# Altium project Light Board.PrjPCB
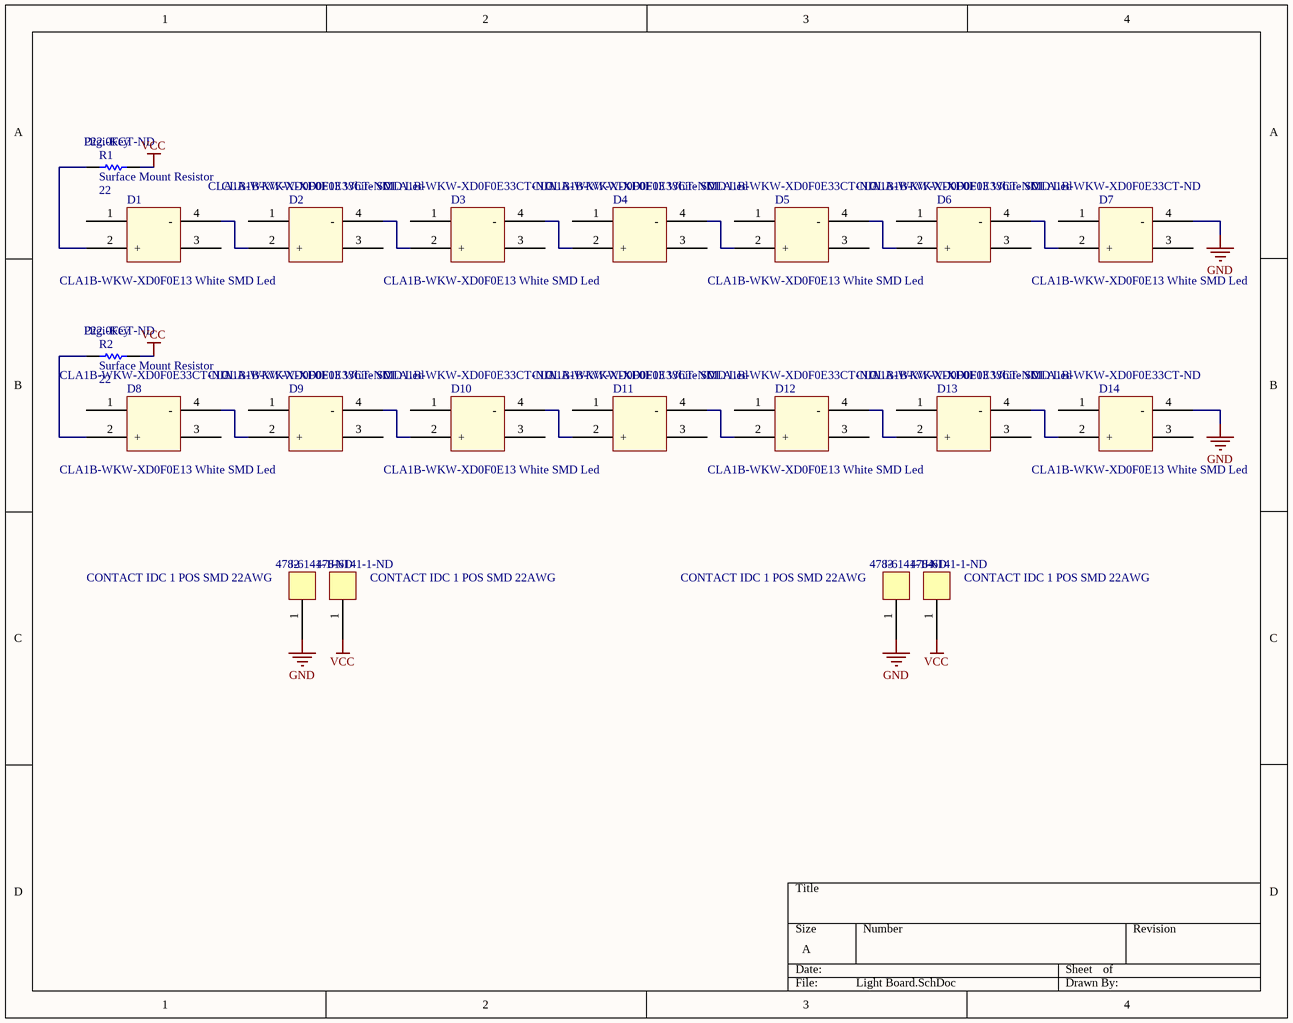
[diagram p0: Light Board.SchDoc]
1 sheet, 20 parts. Net scope: global (net labels, ports and power ports of the same name join across sheets).
Board file: Light Board.PcbDoc

## Sheet Light Board.SchDoc
size A

### Parts
D1  CLA1B-WKW-XD0F0E13 White SMD Led  [CLA1B-WKW-XD0F0E13 White SMD Led]
D2  CLA1B-WKW-XD0F0E13 White SMD Led  Supplier Part Number 1: CLA1B-WKW-XD0F0E33CT-ND  [CLA1B-WKW-XD0F0E13 White SMD Led]
D3  CLA1B-WKW-XD0F0E13 White SMD Led  Supplier Part Number 1: CLA1B-WKW-XD0F0E33CT-ND  [CLA1B-WKW-XD0F0E13 White SMD Led]
D4  CLA1B-WKW-XD0F0E13 White SMD Led  Supplier Part Number 1: CLA1B-WKW-XD0F0E33CT-ND  [CLA1B-WKW-XD0F0E13 White SMD Led]
D5  CLA1B-WKW-XD0F0E13 White SMD Led  Supplier Part Number 1: CLA1B-WKW-XD0F0E33CT-ND  [CLA1B-WKW-XD0F0E13 White SMD Led]
D6  CLA1B-WKW-XD0F0E13 White SMD Led  Supplier Part Number 1: CLA1B-WKW-XD0F0E33CT-ND  [CLA1B-WKW-XD0F0E13 White SMD Led]
D7  CLA1B-WKW-XD0F0E13 White SMD Led  Supplier Part Number 1: CLA1B-WKW-XD0F0E33CT-ND  [CLA1B-WKW-XD0F0E13 White SMD Led]
D8  CLA1B-WKW-XD0F0E13 White SMD Led  Supplier Part Number 1: CLA1B-WKW-XD0F0E33CT-ND  [CLA1B-WKW-XD0F0E13 White SMD Led]
D9  CLA1B-WKW-XD0F0E13 White SMD Led  Supplier Part Number 1: CLA1B-WKW-XD0F0E33CT-ND  [CLA1B-WKW-XD0F0E13 White SMD Led]
D10  CLA1B-WKW-XD0F0E13 White SMD Led  Supplier Part Number 1: CLA1B-WKW-XD0F0E33CT-ND  [CLA1B-WKW-XD0F0E13 White SMD Led]
D11  CLA1B-WKW-XD0F0E13 White SMD Led  Supplier Part Number 1: CLA1B-WKW-XD0F0E33CT-ND  [CLA1B-WKW-XD0F0E13 White SMD Led]
D12  CLA1B-WKW-XD0F0E13 White SMD Led  Supplier Part Number 1: CLA1B-WKW-XD0F0E33CT-ND  [CLA1B-WKW-XD0F0E13 White SMD Led]
D13  CLA1B-WKW-XD0F0E13 White SMD Led  Supplier Part Number 1: CLA1B-WKW-XD0F0E33CT-ND  [CLA1B-WKW-XD0F0E13 White SMD Led]
D14  CLA1B-WKW-XD0F0E13 White SMD Led  Supplier Part Number 1: CLA1B-WKW-XD0F0E33CT-ND  [CLA1B-WKW-XD0F0E13 White SMD Led]
J1  CONTACT IDC 1 POS SMD 22AWG  Supplier Part Number 1: 478-6141-1-ND  [CONTACT IDC 1 POS SMD 22AWG]
J2  CONTACT IDC 1 POS SMD 22AWG  Supplier Part Number 1: 478-6141-1-ND  [CONTACT IDC 1 POS SMD 22AWG]
J3  CONTACT IDC 1 POS SMD 22AWG  Supplier Part Number 1: 478-6141-1-ND  [CONTACT IDC 1 POS SMD 22AWG]
J4  CONTACT IDC 1 POS SMD 22AWG  Supplier Part Number 1: 478-6141-1-ND  [CONTACT IDC 1 POS SMD 22AWG]
R1  Surface Mount Resistor  value 22  Supplier 1: Digi-Key  Supplier Part Number 1: P22.0FCT-ND  [8-1206]
R2  Surface Mount Resistor  value 22  Supplier 1: Digi-Key  Supplier Part Number 1: P22.0FCT-ND  [8-1206]

### Nets
GND: D7.4(-) D14.4(-) J2.1 J3.1
VCC: J1.1 J4.1 R1.2 R2.2
NetD1_2: D1.2(+) R1.1
NetD1_4: D1.4(-) D2.2(+)
NetD2_4: D2.4(-) D3.2(+)
NetD3_4: D3.4(-) D4.2(+)
NetD4_4: D4.4(-) D5.2(+)
NetD5_4: D5.4(-) D6.2(+)
NetD6_4: D6.4(-) D7.2(+)
NetD8_2: D8.2(+) R2.1
NetD8_4: D8.4(-) D9.2(+)
NetD9_4: D9.4(-) D10.2(+)
NetD10_4: D10.4(-) D11.2(+)
NetD11_4: D11.4(-) D12.2(+)
NetD12_4: D12.4(-) D13.2(+)
NetD13_4: D13.4(-) D14.2(+)

Not connected (* = marked no-connect by the designer): D1 1(5) 3; D2 1(5) 3; D3 1(5) 3; D4 1(5) 3; D5 1(5) 3; D6 1(5) 3; D7 1(5) 3; D8 1(5) 3; D9 1(5) 3; D10 1(5) 3; D11 1(5) 3; D12 1(5) 3; D13 1(5) 3; D14 1(5) 3

### Library data of the parts
R1 R2 = Surface Mount Resistor: Resistor; Published: 8-Jun-2000; LatestRevisionDate: 17-Jul-2002; LatestRevisionNote: Re-released for DXP Platform.; PackageReference: AXIAL-0.3; Publisher: Altium Limited; PackageDescription: Axial Device, Thru-Hole; 2 Leads; 0.3 in Pin Spacing
D1-D14 = CLA1B-WKW-XD0F0E13 White SMD Led: Supplier 1: Digi-Key
  D1: Supplier Part Number 1: CLA1B-WKW-XD0F0E33CT-ND
J1-J4 = CONTACT IDC 1 POS SMD 22AWG: Supplier 1: Digi-Key